# Altium schematic sheet 01-POWER.SchDoc
size A4
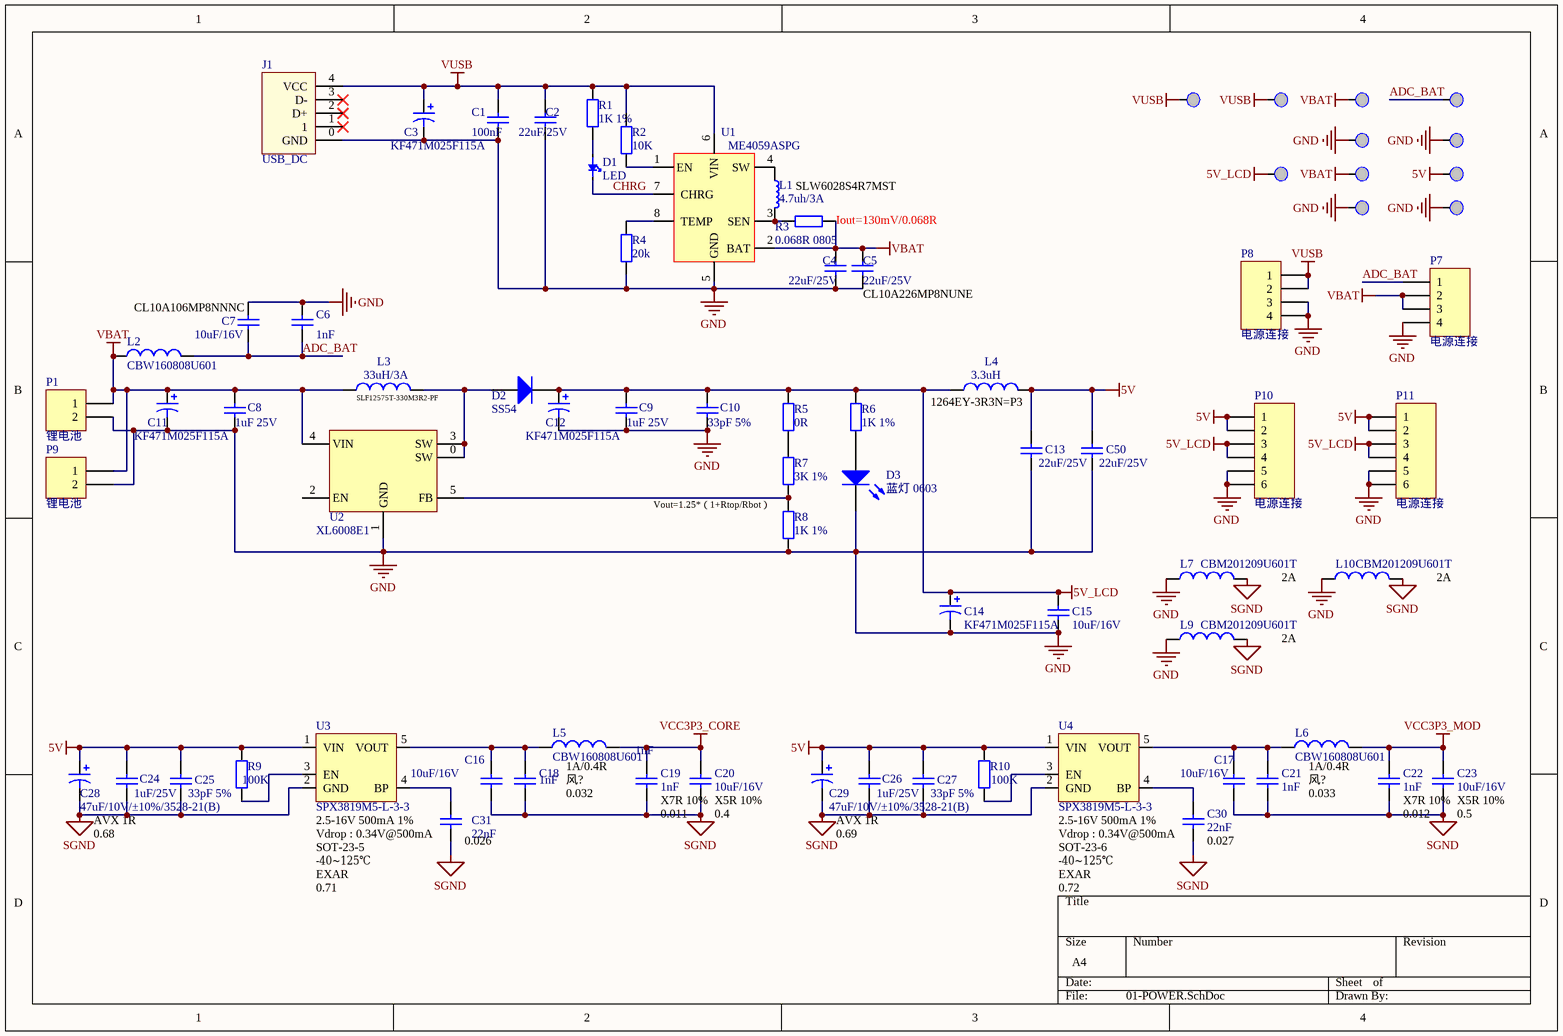
[diagram p0: 01-POWER.SchDoc]

## Parts
C1  100nF  [C1608(CC0603)]
C2  22uF/25V  [C2012(CC0805)]
C3  KF471M025F115A  [RB.3.5/.8mm]
C4  22uF/25V  [C2012(CC0805)]
C5  22uF/25V  [C2012(CC0805)]
C6  1nF  [C1608(CC0603)]
C7  10uF/16V  [C2012(CC0805)]
C8  1uF 25V  [C1608(CC0603)]
C9  1uF 25V  [C1608(CC0603)]
C10  33pF 5%  [C1608(CC0603)]
C11  KF471M025F115A  [RB.3.5/.8mm]
C12  KF471M025F115A  [RB.3.5/.8mm]
C13  22uF/25V  [C2012(CC0805)]
C14  KF471M025F115A  [RB.3.5/.8mm]
C15  10uF/16V  [C2012(CC0805)]
C16  10uF/16V  [C2012(CC0805)]
C17  10uF/16V  [C2012(CC0805)]
C18  1nF  [C1608(CC0603)]
C19  1nF  [C1608(CC0603)]
C20  10uF/16V  [C2012(CC0805)]
C21  1nF  [C1608(CC0603)]
C22  1nF  [C1608(CC0603)]
C23  10uF/16V  [C2012(CC0805)]
C24  1uF/25V  [C1608(CC0603)]
C25  33pF 5%  [C1608(CC0603)]
C26  1uF/25V  [C1608(CC0603)]
C27  33pF 5%  [C1608(CC0603)]
C28  47uF/10V/±10%/3528-21(B)  [LC-CASE-B_3528]
C29  47uF/10V/±10%/3528-21(B)  [LC-CASE-B_3528]
C30  22nF  [C1608(CC0603)]
C31  22nF  [C1608(CC0603)]
C50  22uF/25V  [C2012(CC0805)]
D1  LED  [LC-0805_LED_S1]
D2  SS54  [LC-SMA(DO-214AC)_S5]
D3  蓝灯 0603  [LC-0603_LED_S1]
J1  USB_DC  [USB_DC]
L1  4.7uh/3A  [IND60X60]
L2  CBW160808U601  [C1608(CC0603)]
L3  33uH/3A  [IND125x125]
L4  3.3uH  [IND60X60]
L5  CBW160808U601  [C1608(CC0603)]
L6  CBW160808U601  [C1608(CC0603)]
L7  CBM201209U601T  [C2012(CC0805)]
L9  CBM201209U601T  [C2012(CC0805)]
L10  CBM201209U601T  [C2012(CC0805)]
P1  锂电池  [XH2.54-2A]
P7  电源连接  [HDR1X4]
P8  电源连接  [HDR1X4]
P9  锂电池  [XH2.54-2A]
P10  电源连接  [HDR1X6]
P11  电源连接  [HDR1X6]
R1  1K 1%  [C1608(CC0603)]
R2  10K  [C1608(CC0603)]
R3  0.068R 0805  [C2012(CC0805)]
R4  20k  [C1608(CC0603)]
R5  0R  [C1608(CC0603)]
R6  1K 1%  [C1608(CC0603)]
R7  3K 1%  [C1608(CC0603)]
R8  1K 1%  [C1608(CC0603)]
R9  100K  [C1608(CC0603)]
R10  100K  [C1608(CC0603)]
T1  TP  [M2铜柱]  (value not drawn)
T2  TP  [M2铜柱]  (value not drawn)
T3  TP  [M2铜柱]  (value not drawn)
T4  TP  [M2铜柱]  (value not drawn)
T5  TP  [M2铜柱]  (value not drawn)
T6  TP  [M2铜柱]  (value not drawn)
T7  TP  [M2铜柱]  (value not drawn)
T8  TP  [M2铜柱]  (value not drawn)
T9  TP  [M2铜柱]  (value not drawn)
T10  TP  [M2铜柱]  (value not drawn)
T11  TP  [M2铜柱]  (value not drawn)
U1  ME4059ASPG  [LC-SOP-8_EP_150mil]
U2  XL6008E1  [LC-TO-252-5]
U3  SPX3819M5-L-3-3  [SOT-23-5]
U4  SPX3819M5-L-3-3  [SOT-23-5]

## Nets
5V: C13.2 C24.1 C25.2 C26.1 C27.2 C28.1 C29.1 C50.2 L4.2 P10.1 P10.2 P11.1 P11.2 R9.1 R10.1 T9.1 U3.1(VIN) U4.1(VIN)
5V_LCD: C9.1 C10.1 C12.1 C14.1 C15.2 D2.2(K) L4.1 P10.3 P10.4 P11.3 P11.4 R5.2 R6.2 T10.1
GND: C1.1 C2.1 C3.2 C4.1 C5.1 C6.2 C7.2 C8.2 C9.2 C10.2 C11.2 C12.2 C13.1 C14.2 C15.1 C50.1 D3.K J1.0(GND) L7.1 L9.1 L10.1 P1.2 P7.4 P8.3 P8.4 P9.2 P10.5 P10.6 P11.5 P11.6 R4.2 R8.1 T2.1 T4.1 T6.1 T7.1 U1.5(GND) U2.1(GND)
SGND: C16.1 C17.1 C18.1 C19.1 C20.1 C21.1 C22.1 C23.1 C24.2 C25.1 C26.2 C27.1 C28.2 C29.2 C30.1 C31.1 L7.2 L9.2 L10.2 U3.2(GND) U4.2(GND)
VBAT: C4.2 C5.2 C8.1 C11.1 L2.1 L3.1 P1.1 P7.2 P7.3 P9.1 R3.1 T5.1 T8.1 U1.2(BAT) U2.4(VIN)
VCC3P3_CORE: C19.2 C20.2 L5.2
VCC3P3_MOD: C22.2 C23.2 L6.2
VUSB: C1.2 C2.2 C3.1 J1.4(VCC) P8.1 P8.2 R1.1 R2.1 T1.1 T11.1 U1.6(VIN)
ADC_BAT: C6.1 C7.1 L2.2 P7.1 T3.1
CHRG: D1.K U1.7(CHRG)
NetC16_2: C16.2 C18.2 L5.1 U3.5(VOUT)
NetC17_2: C17.2 C21.2 L6.1 U4.5(VOUT)
NetC30_2: C30.2 U4.4(BP)
NetC31_2: C31.2 U3.4(BP)
NetD1_A: D1.A R1.2
NetD2_1: D2.1(A) L3.2 U2.0(SW) U2.3(SW)
NetD3_A: D3.A R6.1
NetL1_1: L1.1 U1.4(SW)
NetL1_2: L1.2 R3.2 U1.3(SEN)
NetR2_2: R2.2 U1.1(EN)
NetR4_1: R4.1 U1.8(TEMP)
NetR5_1: R5.1 R7.2
NetR7_1: R7.1 R8.2 U2.5(FB)
NetR9_2: R9.2 U3.3(EN)
NetR10_2: R10.2 U4.3(EN)

Not connected (* = marked no-connect by the designer): J1 1* 2(D+)* 3(D-)*; U2 2(EN)

## Notes on the sheet
- SLW6028S4R7MST
- (near R3) Iout=130mV/0.068R
- (near C7) CL10A106MP8NNNC
- (near C5) CL10A226MP8NUNE
- (near L3) SLF12575T-330M3R2-PF
- (near L4) 1264EY-3R3N=P3
- Vout=1.25*（1+Rtop/Rbot）
- 2A
- (near L10) 2A
- (near L5) 1A/0.4R
- 风?
- (near L6) 1A/0.4R
- AVX 1R
- 0.68
- 2.5-16V 500mA 1%
- (near C31) Vdrop : 0.34V@500mA
- SOT-23-5
- (near C31) 0.026
- 0.032
- (near C20) X7R 10%
- 0.011
- (near C20) X5R 10%
- (near C20) 0.4
- 0.69
- (near C30) Vdrop : 0.34V@500mA
- SOT-23-6
- (near C30) 0.027
- 0.033
- (near C23) X7R 10%
- 0.012
- (near C23) X5R 10%
- (near C23) 0.5
- -40~125℃
- EXAR
- 0.71
- 0.72

## Library data of the parts
C1 C2 C4 C5 C13 C50 = Cap: Capacitor; Value: 100pF; Published: 8-Jun-2000; LatestRevisionDate: 17-Jul-2002; LatestRevisionNote: Re-released for DXP Platform.; PackageReference: RAD-0.3; Publisher: Altium Limited; PackageDescription: Radial Cap, Thru-Hole; 2 Leads; 0.3 in Pin Spacing
C3 C11 C14 C28 C29 = Cap Pol1: Polarized Capacitor (Radial); Published: 8-Jun-2000; LatestRevisionDate: 17-Jul-2002; LatestRevisionNote: Re-released for DXP Platform.; PackageReference: RB7.6-15; Publisher: Altium Limited; PackageDescription: Polarized Capacitor (Radial); 2 Leads
  C3 C11 C14: Value: KF471M025F115A
  C28 C29: Value: 47uF/10V/±10%/3528-21(B)
C6 C10 C18 C19 C21 C22 C24-C27 C30 C31 = Cap: Capacitor; Published: 8-Jun-2000; LatestRevisionDate: 17-Jul-2002; LatestRevisionNote: Re-released for DXP Platform.; PackageReference: RAD-0.3; Publisher: Altium Limited
  C6 C18 C19 C21 C22: Value: 1nF
  C10 C25 C27: Value: 33pF 5%
  C24 C26: Value: 1uF/25V
  C30 C31: Value: 22nF
C7 C15-C17 C20 C23 = Cap: Capacitor; Value: 10uF/25V/0805; Published: 8-Jun-2000; LatestRevisionDate: 17-Jul-2002; LatestRevisionNote: Re-released for DXP Platform.; PackageReference: RAD-0.3; Publisher: Altium Limited
C8 C9 = Cap: Capacitor; Value: 1uF/25V; Published: 8-Jun-2000; LatestRevisionDate: 17-Jul-2002; LatestRevisionNote: Re-released for DXP Platform.; PackageReference: RAD-0.3; Publisher: Altium Limited
C12 = Cap Pol1: Polarized Capacitor (Radial); Value: KF102M025G200A; Published: 8-Jun-2000; LatestRevisionDate: 17-Jul-2002; LatestRevisionNote: Re-released for DXP Platform.; PackageReference: RB7.6-15; Publisher: Altium Limited; PackageDescription: Polarized Capacitor (Radial); 2 Leads
D2 = SMA(DO-214AC) M7: 二极管; ComponentLink1Description: 供应商链接; ComponentLink1URL: http://www.szlcsc.com/product/details_2841.html; Package: SMA(DO-214AC); Supplier: LC; SuppliersPartNumber: C2464
D3 = 0603 蓝灯: 发光二极管; ComponentLink1Description: 供应商链接; ComponentLink1URL: http://www.szlcsc.com/product/details_73150.html; Package: 0603; Supplier: LC; SuppliersPartNumber: C72041
L1 = 电感
L2 L4-L6 = Inductor: Code_IEC: 1005; Published: 8-Jun-2000; LatestRevisionDate: 29-May-2009; LatestRevisionNote: IPC-7351 Footprint Added.; PackageReference: 0402-A; Publisher: Altium Limited; PackageDescription: Chip Inductor; Code_JEITA: 0402
  L2 L5 L6: Value: CBW160808U601
  L4: Value: 3.3uH
L3 = Inductor: Code_IEC: 1005; Value: 3.3uH; Published: 8-Jun-2000; LatestRevisionDate: 29-May-2009; LatestRevisionNote: IPC-7351 Footprint Added.; PackageReference: 0402-A; Publisher: Altium Limited; PackageDescription: Chip Inductor; Code_JEITA: 0402
L7 L9 L10 = Inductor: Code_IEC: 1005; Value: CBW160808U601; Published: 8-Jun-2000; LatestRevisionDate: 29-May-2009; LatestRevisionNote: IPC-7351 Footprint Added.; PackageReference: 0402-A; Publisher: Altium Limited; PackageDescription: Chip Inductor; Code_JEITA: 0402
P1 P9 = Header 2: Header, 2-Pin; LatestRevisionDate: 17-Jul-2002; LatestRevisionNote: Re-released for DXP Platform.; Publisher: Altium Limited
P7 P8 = Header 4: Header, 4-Pin; LatestRevisionDate: 17-Jul-2002; LatestRevisionNote: Re-released for DXP Platform.; Publisher: Altium Limited
P10 P11 = Header 6: Header, 6-Pin; LatestRevisionDate: 17-Jul-2002; LatestRevisionNote: Re-released for DXP Platform.; Publisher: Altium Limited
R1 R9 R10 = Res2: Resistor; Published: 8-Jun-2000; LatestRevisionDate: 17-Jul-2002; LatestRevisionNote: Re-released for DXP Platform.; PackageReference: AXIAL-0.4; Publisher: Altium Limited
  R1: PackageDescription: Axial Device, Thru-Hole; 2 Leads; 0.4 in Pin Spacing; Value: 1K
  R9 R10: Value: 100K
R2-R4 = Res2: Resistor; Value: 1K; Published: 8-Jun-2000; LatestRevisionDate: 17-Jul-2002; LatestRevisionNote: Re-released for DXP Platform.; PackageReference: AXIAL-0.4; Publisher: Altium Limited; PackageDescription: Axial Device, Thru-Hole; 2 Leads; 0.4 in Pin Spacing
R5-R7 = Res2: Resistor; Value: 10K 1%; Published: 8-Jun-2000; LatestRevisionDate: 17-Jul-2002; LatestRevisionNote: Re-released for DXP Platform.; PackageReference: AXIAL-0.4; Publisher: Altium Limited
R8 = Res2: Resistor; Value: 44.2K 1%; Published: 8-Jun-2000; LatestRevisionDate: 17-Jul-2002; LatestRevisionNote: Re-released for DXP Platform.; PackageReference: AXIAL-0.4; Publisher: Altium Limited
U1 = ME4059: 4.2v/2A
U3 U4 = RT9193